# EAGLE design ESP8266 (EAGLE 7.7.0)
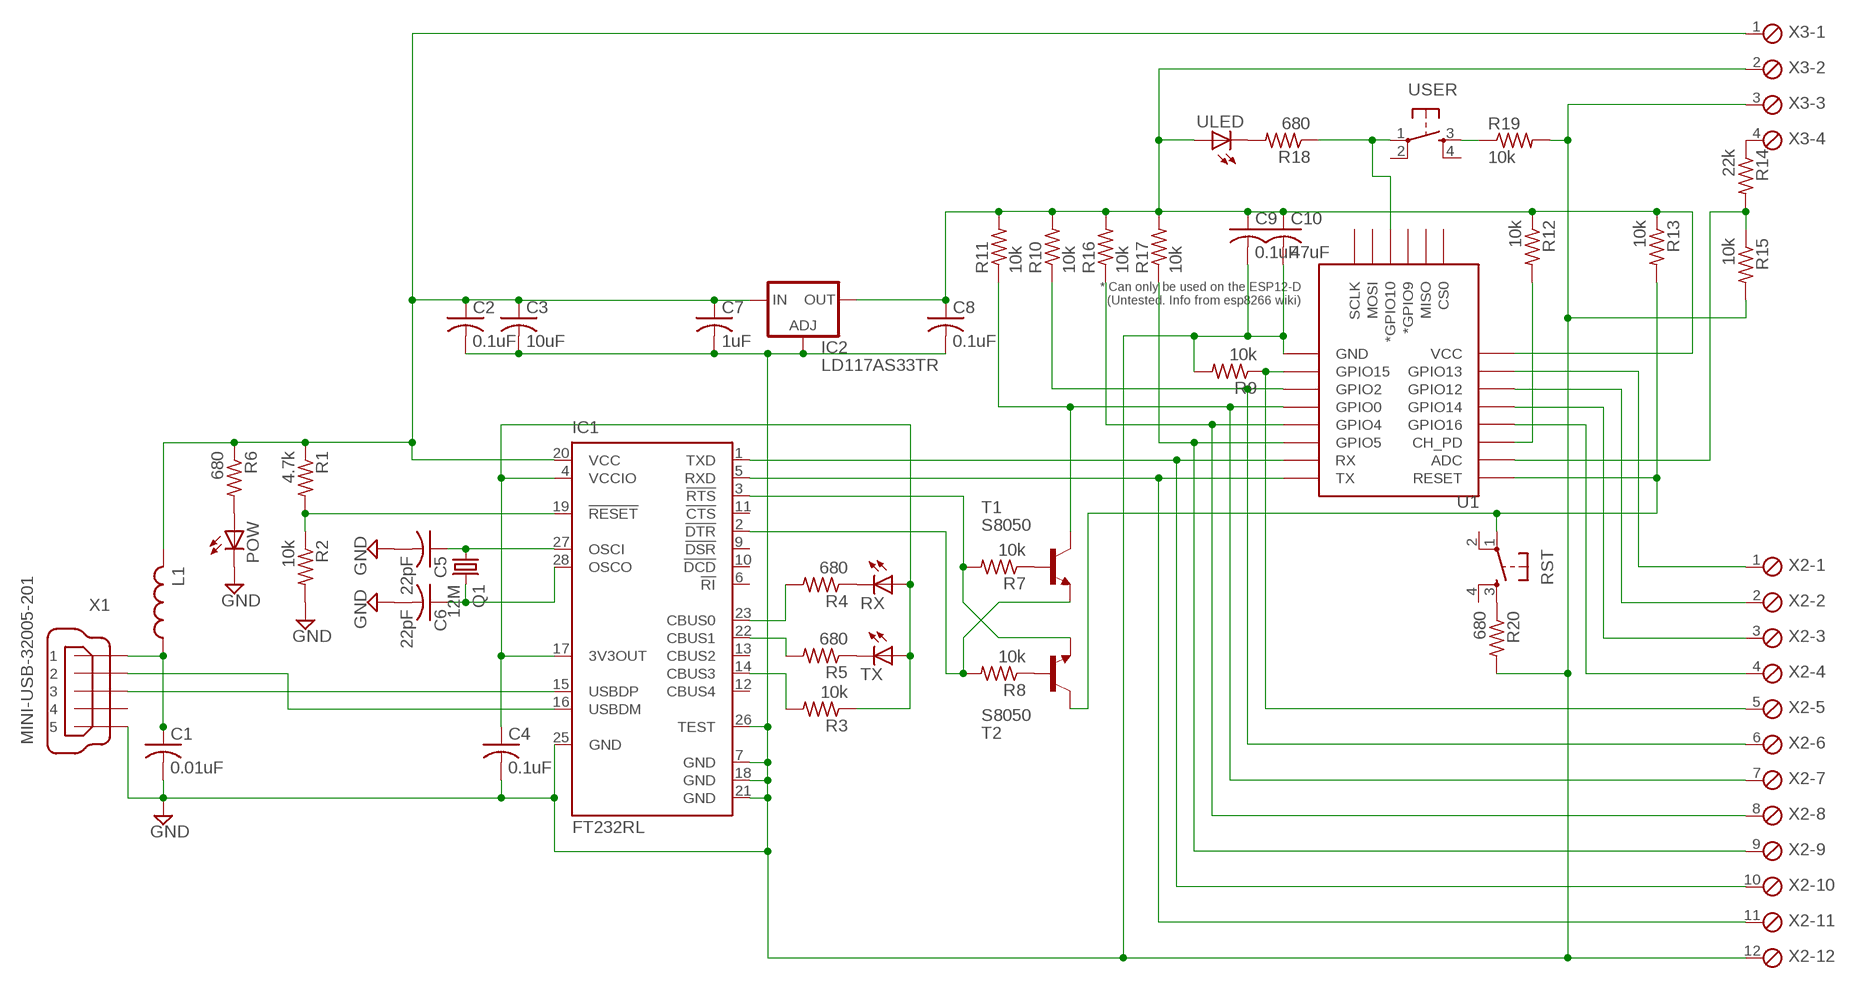
[diagram p0: schematic, sheet 1]

## Parts
C1  0.01uF  C-USC0805  [C0805]
C2  0.1uF  C-USC0805  [C0805]
C3  10uF  C-USC0805  [C0805]
C4  0.1uF  C-USC0805  [C0805]
C5  22pF  C-USC0805  [C0805]
C6  22pF  C-USC0805  [C0805]
C7  1uF  C-USC0805  [C0805]
C8  0.1uF  C-USC0805  [C0805]
C9  0.1uF  C-USC0805  [C0805]
C10  47uF  C-USC0805  [C0805]
IC1  FT232RL  [SSOP28]
IC2  LD117AS33TR  [SOT223]
L1  L-USL2012C  [L2012C]
POW  LEDCHIP-LED0805  [CHIP-LED0805]
Q1  12M  CRYSTALSM49  [SM49]
R1  4.7k  R-US_R0805  [R0805]
R2  10k  R-US_R0805  [R0805]
R3  10k  R-US_R0805  [R0805]
R4  680  R-US_R0805  [R0805]
R5  680  R-US_R0805  [R0805]
R6  680  R-US_R0805  [R0805]
R7  10k  R-US_R0805  [R0805]
R8  10k  R-US_R0805  [R0805]
R9  10k  R-US_R0805  [R0805]
R10  10k  R-US_R0805  [R0805]
R11  10k  R-US_R0805  [R0805]
R12  10k  R-US_R0805  [R0805]
R13  10k  R-US_R0805  [R0805]
R14  22k  R-US_R0805  [R0805]
R15  10k  R-US_R0805  [R0805]
R16  10k  R-US_R0805  [R0805]
R17  10k  R-US_R0805  [R0805]
R18  680  R-US_R0805  [R0805]
R19  10k  R-US_R0805  [R0805]
R20  680  R-US_R0805  [R0805]
RST  DTSM-6  [DTSM-6]
RX  LEDCHIP-LED0805  [CHIP-LED0805]
T1  S8050  MMBT2222ALT1-NPN-SOT23-BEC  [SOT23-BEC]
T2  S8050  MMBT2222ALT1-NPN-SOT23-BEC  [SOT23-BEC]
TX  LEDCHIP-LED0805  [CHIP-LED0805]
U1  ESP12ESMD  [ESP12E-SMD]
ULED  LEDCHIP-LED0805  [CHIP-LED0805]
USER  DTSM-6  [DTSM-6]
X1  MINI-USB-32005-201  [32005-201]
X2  MPT12  [12POL254]
X3  MPT4  [4POL254]

## Nets
GND: C1.2 C2.2 C3.2 C4.2 C5.2 C6.2 C7.2 C8.2 C9.2 C10.2 IC1.7(GND) IC1.18(GND) IC1.21(GND) IC1.25(GND) IC1.26(TEST) IC2.1(ADJ) POW.C R2.2 R9.2 R15.2 R19.2 R20.2 U1.GND X1.5 X2.12 X3.3
N$1: POW.A R6.2
N$2: IC1.15(USBDP) X1.3
N$3: IC1.16(USBDM) X1.2
N$4: C5.1 IC1.27(OSCI) Q1.1
N$5: C6.1 IC1.28(OSCO) Q1.2
N$6: IC1.19(!RESET) R1.2 R2.1
N$8: IC1.14(CBUS3) R3.2
N$9: IC1.22(CBUS1) R5.2
N$10: IC1.23(CBUS0) R4.2
N$11: R4.1 RX.C
N$12: R5.1 TX.C
N$13: IC1.1(TXD) U1.RXD0(RX) X2.10
N$14: IC1.5(RXD) U1.TXD0(TX) X2.11
N$15: R7.1 T1.B
N$16: R8.1 T2.B
N$17: IC1.3(!RTS) R7.2 T2.E
N$18: IC1.2(!DTR) R8.2 T1.E
N$19: R10.1 U1.GPIO2 X2.6
N$20: R9.1 U1.GPIO15 X2.5
N$21: R16.1 U1.GPIO4 X2.8
N$22: R12.2 U1.CH_PD
N$23: R13.2 RST.1 T2.C U1.RESET
N$24: C4.1 IC1.4(VCCIO) IC1.17(3V3OUT) R3.1 RX.A TX.A
N$25: R14.2 R15.1 U1.ADC
N$28: R17.1 U1.GPIO5 X2.9
N$29: R11.1 T1.C U1.GPIO0 X2.7
N$30: R18.2 ULED.C
N$31: R18.1 U1.GPIO10(*GPIO10) USER.1
N$32: R19.1 USER.3
N$33: R14.1 X3.4
N$34: R20.1 RST.3
N$37: U1.GPIO13 X2.1
N$38: U1.GPIO12 X2.2
N$39: U1.GPIO14 X2.3
N$40: U1.GPIO16 X2.4
V33E: C8.1 C9.1 C10.1 IC2.4(OUT) R10.2 R11.2 R12.1 R13.1 R16.2 R17.2 U1.VCC ULED.A X3.2
VBUS: C1.1 L1.1 X1.1
VCC: C2.1 C3.1 C7.1 IC1.20(VCC) IC2.3(IN) L1.2 R1.1 R6.1 X3.1
Unconnected: IC1.6(!RI) IC1.9(!DSR) IC1.10(!DCD) IC1.11(!CTS) IC1.12(CBUS4) IC1.13(CBUS2) RST.2 RST.4 U1.CS0 U1.GPIO9(*GPIO9) U1.MISO U1.MOSI U1.SCLK USER.2 USER.4 X1.4

## Library data of the parts
C1-C10 = rcl:C-US: CAPACITOR, American symbol
IC1 = ftdichip:FT232R: Source: http://www.ftdichip.com/Documents/DataSheets/DS_FT232R_v104.pdf; MPN: FT232RL; OC_FARNELL: 1146032; OC_NEWARK: 91K9918
IC2 = v-reg:LD117A?*: Low drop fixed and adjustable positive voltage regulators 1 A Source: http://www.st.com/stonline/products/literature/ds/7194/ld1117axx.pdf
L1 = rcl:L-US: INDUCTOR, American symbol
POW RX TX ULED = led:LED: LED OSRAM: - CHIPLED LG R971, LG N971, LY N971, LG Q971, LY Q971, LO R971, LY R971 LH N974, LH R974 LS Q976, LO Q976, LY Q976 LO Q996 - Hyper CHIPLED LW Q18S LB Q993, LB Q99A, LB R99A - SideLED LS A670, LO A670, LY A670, LG A670, LP A670 LB A673, LV A673, LT A673, LW A673 LH A674 LY A675 LS A676, LA A676, LO A676, LY A676, LW A676 LS A679, LY A679, LG A679 - Hyper Micro SIDELED® LS Y876, LA Y876, LO Y876, LY Y876 LT Y87S - SmartLED LW L88C, LW L88S LB L89C, LB L89S, LG L890 LS L89K, LO L89K, LY L89K LS L896, LA L896, LO L896, LY L896 - TOPLED LS T670, LO T670, LY T670, LG T670, LP T670 LSG T670, LSP T670, LSY T670, LOP T670, LYG T670 LG T671, LOG T671, LSG T671 LB T673, LV T673, LT T673, LW T673 LH T674 LS T676, LA T676, LO T676, LY T676, LB T676, LH T676, LSB T676, LW T676 LB T67C, LV T67C, LT T67C, LS T67K, LO T67K, LY T67K, LW E67C LS E67B, LA E67B, LO E67B, LY E67B, LB E67C, LV E67C, LT E67C LW T67C LS T679, LY T679, LG T679 LS T770, LO T770, LY T770, LG T770, LP T770 LB T773, LV T773, LT T773, LW T773 LH T774 LS E675, LA E675, LY E675, LS T675 LS T776, LA T776, LO T776, LY T776, LB T776 LHGB T686 LT T68C, LB T68C - Hyper Mini TOPLED® LB M676 - Mini TOPLED Santana® LG M470 LS M47K, LO M47K, LY M47K Source: http://www.osram.convergy.de LUXEON: - LUMILED® LXK2-PW12-R00, LXK2-PW12-S00, LXK2-PW14-U00, LXK2-PW14-V00 LXK2-PM12-R00, LXK2-PM12-S00, LXK2-PM14-U00 LXK2-PE12-Q00, LXK2-PE12-R00, LXK2-PE12-S00, LXK2-PE14-T00, LXK2-PE14-U00 LXK2-PB12-K00, LXK2-PB12-L00, LXK2-PB12-M00, LXK2-PB14-N00, LXK2-PB14-P00, LXK2-PB14-Q00 LXK2-PR12-L00, LXK2-PR12-M00, LXK2-PR14-Q00, LXK2-PR14-R00 LXK2-PD12-Q00, LXK2-PD12-R00, LXK2-PD12-S00 LXK2-PH12-R00, LXK2-PH12-S00 LXK2-PL12-P00, LXK2-PL12-Q00, LXK2-PL12-R00 Source: www.luxeon.com KINGBRIGHT: KA-3528ASYC Source: www.kingbright.com
Q1 = crystal:CRYSTAL: CRYSTAL; OC_FARNELL: unknown; OC_NEWARK: unknown
R1-R20 = rcl:R-US_: RESISTOR, American symbol
RST USER = switch-tact:DTSM-6
T1 T2 = transistor:*-NPN-: NPN Transistror BF959 corrected 2008.03.06
U1 = esp8266modules:ESP12E: ESP12E Module
X1 = con-cypressindustries:MINI-USB-: MINI USB-B Conector Source: www.cypressindustries.com; OC_FARNELL: unknown; OC_NEWARK: unknown
X2 = con-phoenix-254:MPT12: PHOENIX CONNECTOR; OC_FARNELL: unknown; OC_NEWARK: unknown
X3 = con-phoenix-254:MPT4: PHOENIX CONNECTOR; OC_FARNELL: unknown; OC_NEWARK: unknown

## Board
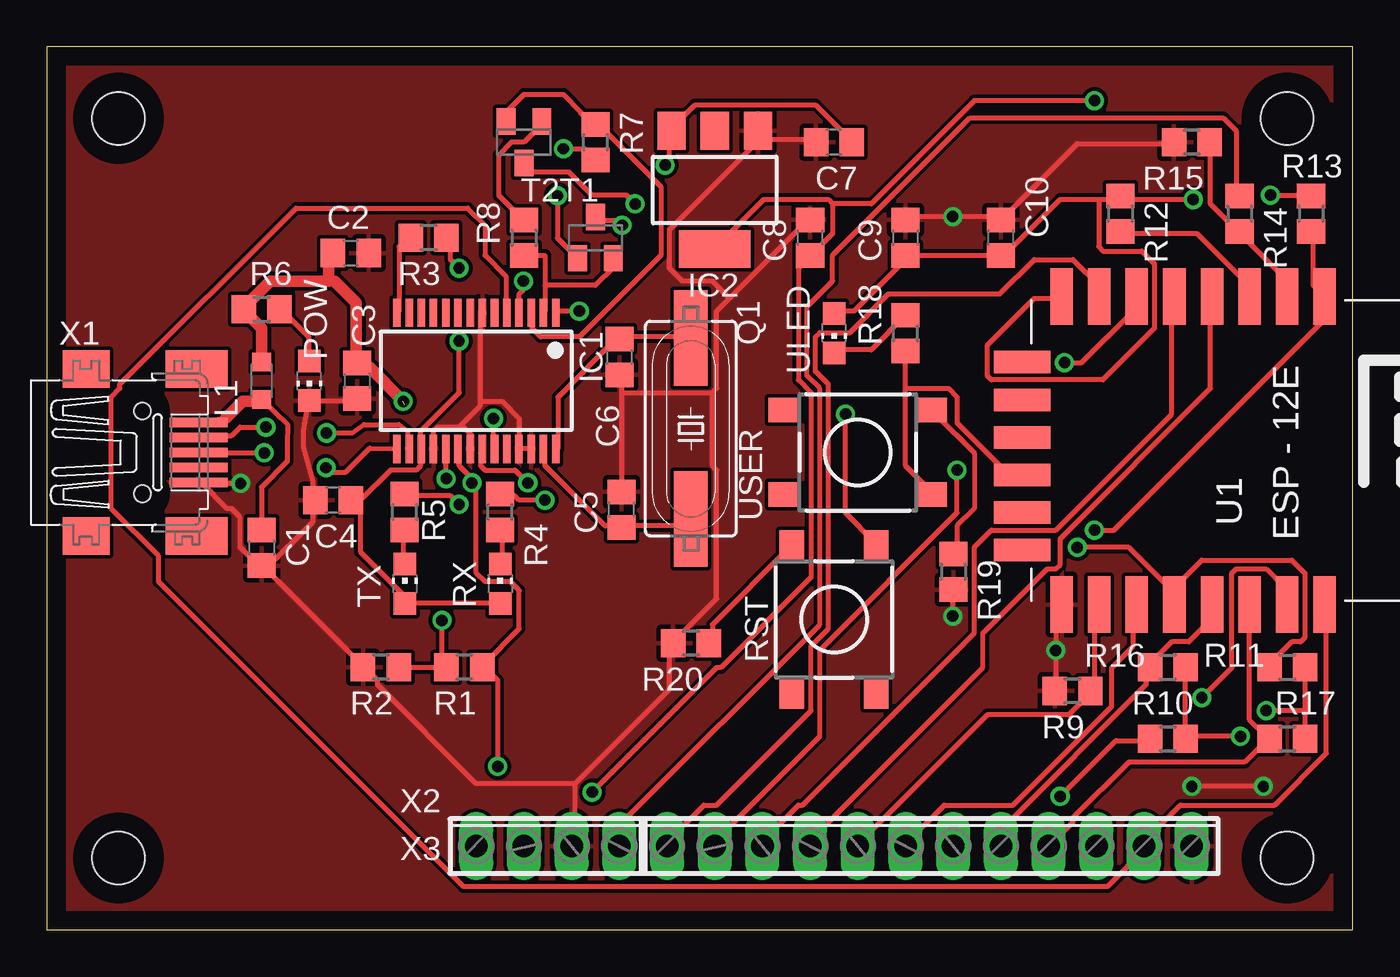
[diagram p1: board, top side]
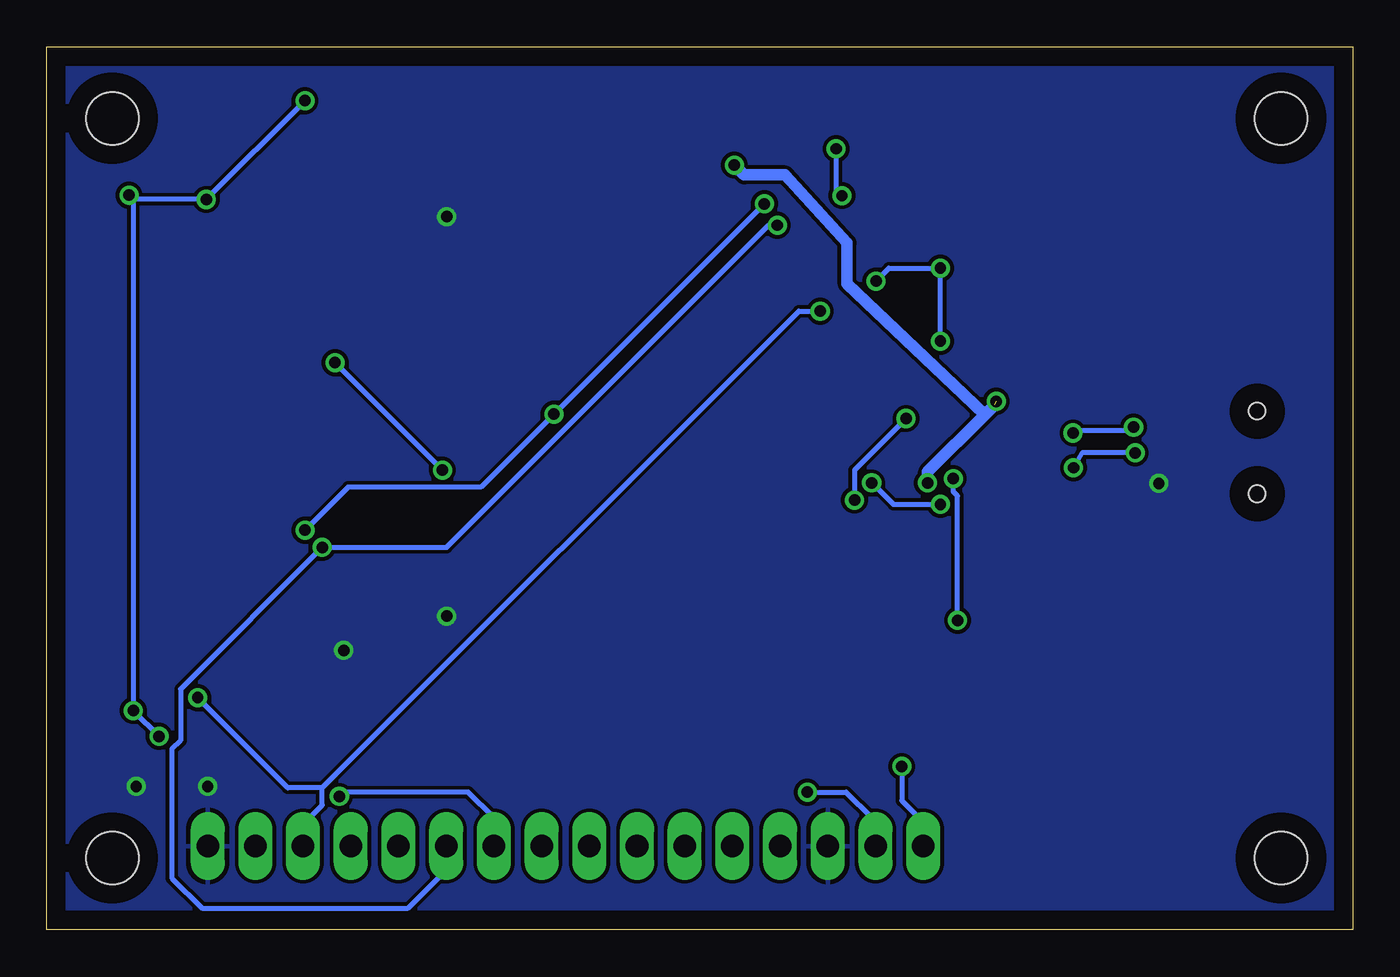
[diagram p2: board, bottom side, seen from below]

Size 69.52 x 46.98 mm. Coordinates in mm from the lower left corner, seen from the top.
Outline: 0,0 69.52,0 69.52,46.98 0,46.98 0,0
Copper layers (1*16): Top 0.035mm / dielectric 1.5mm / Bottom 0.035mm
Design rules "default": minimum track width 10mil, minimum drill 24mil, track to track 8mil, track to pad 8mil, pad to pad 8mil, via to via 8mil, smd to smd 8mil, copper to edge 40mil, drill to drill 8mil, minimum pad ring 10mil, minimum via ring 8mil, stop-mask expansion 4mil, vias tented up to drill 0mil, thermal gap 10mil
Holes 2.8 mm at 3.81,43.18 3.81,3.81 66.04,3.81 66.04,43.18

### Footprints (pad centres in the part's own frame; a part is rotated, then mirrored left to right if it is on the bottom)
C0805 = smd 1.3 x 1.5: 1 -0.95,0; 2 0.95,0
SSOP28 = smd 0.4 x 1.5: 1 -4.225,-3.625; 2 -3.575,-3.625; 3 -2.925,-3.625; 4 -2.275,-3.625; 5 -1.625,-3.625; 6 -0.975,-3.625; 7 -0.325,-3.625; 8 0.325,-3.625; 9 0.975,-3.625; 10 1.625,-3.625; 11 2.275,-3.625; 12 2.925,-3.625; 13 3.575,-3.625; 14 4.225,-3.625; 15 4.225,3.625; 16 3.575,3.625; 17 2.925,3.625; 18 2.275,3.625; 19 1.625,3.625; 20 0.975,3.625; 21 0.325,3.625; 22 -0.325,3.625; 23 -0.975,3.625; 24 -1.625,3.625; 25 -2.275,3.625; 26 -2.925,3.625; 27 -3.575,3.625; 28 -4.225,3.625
SOT223 = smd 1.5 x 2: 1 -2.3,-3.15; 2 0,-3.15; 3 2.3,-3.15 | smd 3.8 x 2: 4 0,3.15
L2012C = smd 1 x 1: 1 -1,0; 2 1,0
CHIP-LED0805 = smd 1.2 x 1.2: A 0,-1.05; C 0,1.05
SM49 = smd 5.08 x 1.778: 1 -4.826,0; 2 4.826,0
R0805 = smd 1.3 x 1.5: 1 -0.95,0; 2 0.95,0
DTSM-6 = smd 1.55 x 1.3: 1 -3.975,2.25; 2 3.975,2.25; 3 -3.975,-2.25; 4 3.975,-2.25
SOT23-BEC = smd 1 x 1.4: B -0.95,-1.1; C 0,1.1; E 0.95,-1.1
ESP12E-SMD = smd 3 x 1.2: ADC -8.3,3.8; CH_PD -8.3,1.8; GND 8.1,-8.2; GPIO0 8.1,-2.2; GPIO2 8.1,-4.2; GPIO4 8.1,-0.2; GPIO5 8.1,1.8; GPIO12 -8.3,-4.2; GPIO13 -8.3,-6.2; GPIO14 -8.3,-2.2; GPIO15 8.1,-6.2; GPIO16 -8.3,-0.2; RESET -8.3,5.8; RXD0 8.1,3.8; TXD0 8.1,5.8; VCC -8.3,-8.2 | smd 1.2 x 3: CS0 -4.8,-10.3; GPIO9 -0.8,-10.3; GPIO10 1.2,-10.3; MISO -2.8,-10.3; MOSI 3.2,-10.3; SCLK 5.2,-10.3
32005-201 = smd 3.1 x 0.5: 1 3,1.6; 2 3,0.8; 3 3,0; 4 3,-0.8; 5 3,-1.6 | smd 2.5 x 2: M1 -3,-4.45; M2 -3,4.45 | smd 3.3 x 2: M3 2.9,4.45; M4 2.9,-4.45 | hole 0.9: 0,2.2; 0,-2.2
12POL254 = drill 1.2 long: 1 -13.97,0; 2 -11.43,0; 3 -8.89,0; 4 -6.35,0; 5 -3.81,0; 6 -1.27,0; 7 1.27,0; 8 3.81,0; 9 6.35,0; 10 8.89,0; 11 11.43,0; 12 13.97,0
4POL254 = drill 1.2 long: 1 -3.81,0; 2 -1.27,0; 3 1.27,0; 4 3.81,0

### Placement (x,y rotation side)
C1  11.43,20.32 270 top
C2  16.18,36.01 0 top
C3  16.51,29.21 270 top
C4  15.24,22.86 180 top
C5  30.6,22.35 90 top
C6  30.48,30.48 270 top
C7  41.91,41.91 180 top
C8  40.64,36.83 90 top
C9  45.72,36.83 90 top
C10  50.8,36.83 90 top
IC1  22.86,29.21 180 top
IC2  35.56,39.37 180 top
L1  11.43,29.21 90 top
POW  13.97,29.21 180 top
Q1  34.29,26.67 90 top
R1  22.23,13.97 180 top
R2  17.78,13.97 180 top
R3  20.32,36.83 180 top
R4  24.13,22.23 90 top
R5  19.05,22.23 90 top
R6  11.43,33.02 0 top
R7  29.21,41.91 90 top
R8  25.4,36.83 270 top
R9  54.61,12.7 180 top
R10  59.69,10.16 0 top
R11  66.04,13.97 0 top
R12  57.15,38.1 270 top
R13  67.31,38.1 270 top
R14  63.5,38.1 270 top
R15  60.96,41.91 180 top
R16  59.69,13.97 0 top
R17  66.04,10.16 0 top
R18  45.72,31.75 90 top
R19  48.26,19.05 270 top
R20  34.29,15.24 180 top
RST  41.91,16.51 270 top
RX  24.13,18.41 0 top
T1  29.21,36.83 0 top
T2  25.4,41.91 180 top
TX  19.05,18.41 0 top
U1  62.23,25.4 270 top
ULED  41.91,31.75 180 top
USER  43.18,25.4 180 top
X1  5.08,25.4 0 top
X2  46.99,4.45 0 top
X3  26.67,4.45 0 top

### Tracks (layer width: path | path; a pad name or v marks a point on that pad's centre or on a via)
GND  (via drill 0.6, 0.61)
  Top 0.254: 25.15,25.6 25.6,25.6 IC1.26 | 21.95,26.75 22.17,26.75 22.63,26.29 22.63,25.6 IC1.21 | 21.95,26.75 20.8,26.75 20.57,26.52 20.57,25.6 IC1.18 | 23.09,28.12 23.09,27.89 21.95,26.75 | 23.09,28.12 23.09,32.69 IC1.7 | 25.15,25.6 25.15,27.2 24.23,28.12 23.09,28.12 | 25.15,25.6 IC1.25 | C3.2 16.46,28.12 14.17,28.12 POW.C 13.95,28.12 13.65,26.58 13.65,25.66 14.17,23.88 14.17,22.86 | 11.66,19.2 11.43,19.43 C1.2 | 11.66,19.2 16.69,14.17 R2.2 16.92,13.95 17.6,13.26 17.6,13.03 22.86,7.77 28.12,7.77 | 14.17,22.86 14.17,21.72 11.66,19.2 | 11.66,19.2 C1.2 | 14.17,22.86 C4.2 | X1.5 8.23,23.77 9.6,22.4 9.83,22.4 10.29,21.95 10.29,20.34 11.43,19.2 C1.2 | 38.18,42.29 37.95,42.52 IC2.1 38.18,42.29 | 38.18,42.29 38.41,42.06 40.92,42.06 C7.2 | 30.63,28.57 30.63,23.32 C5.2 | 30.63,28.57 30.63,29.49 C6.2 | 36.35,33.6 35.66,32.92 35.66,28.8 35.43,28.57 | 36.35,33.6 40.46,37.72 C8.2 | 30.63,28.57 35.43,28.57 | 38.18,42.29 33.15,37.26 33.15,35.2 33.83,34.52 35.43,34.52 36.35,33.6 | C9.2 45.72,37.95 v48.23,37.95 50.75,37.95 C10.2 50.98,37.95 54.86,41.83 59.89,41.83 R15.2 | R9.2 53.72,12.8 v53.72,14.86 53.72,16.92 53.95,17.14 U1.GND | 28.12,7.77 33.15,12.8 33.15,15.09 R20.2 33.38,15.32 35.66,17.6 35.66,24.46 35.43,24.69 35.43,28.57 | 28.12,7.77 28.12,4.57 X3.3 | v48.23,16.69 48.23,18.06 R19.2 | 8.44,23.75 v10.31,23.75 | v64.77,7.62 v60.96,7.62
  pour Bottom: -5.08,50.8 80.01,50.8 80.01,-2.54 -5.08,-2.54
  pour Top: -1.27,48.26 69.85,48.26 69.85,-1.27 -1.27,-1.27
N$1
  Top 0.254: POW.A 13.95,30.4 13.95,31.55 12.57,32.92 R6.2
N$2  (via drill 0.61)
  Top 0.254: v14.86,24.58 15.09,24.35 15.92,24.35 17.19,25.62 18.52,25.6 IC1.15 | v11.57,25.38 8.23,25.38 X1.3
  Bottom 0.254: v14.86,24.58 14.4,25.38 v11.57,25.38
N$3  (via drill 0.61)
  Top 0.254: v14.88,26.43 16.27,26.43 16.88,26.88 18.75,26.88 19.2,26.52 19.2,25.6 IC1.16 | v11.66,26.75 10.29,26.75 9.83,26.29 8.23,26.29 X1.2
  Bottom 0.254: v11.66,26.75 11.88,26.56 14.38,26.56 v14.88,26.43
N$4
  Top 0.254: Q1.1 34.29,21.72 34.06,21.49 30.63,21.49 C5.1 30.4,21.49 29.72,21.49 26.52,24.69 26.52,25.38 IC1.27
N$5
  Top 0.254: IC1.28 27.2,25.6 27.2,28.35 30.4,31.55 C6.1 30.63,31.55 34.29,31.55 Q1.2
N$6  (via drill 0.61)
  Top 0.254: 21.03,13.95 21.26,13.95 R1.2 21.03,13.95 | 21.03,13.95 18.75,13.95 R2.1 | v21.26,24 21.26,25.38 IC1.19 | 21.03,13.95 v21.03,16.46
  Bottom 0.254: v21.26,24 21.26,23.32 21.03,23.09 v21.03,16.46
N$8
  Top 0.254: IC1.14 18.75,32.92 18.75,36.35 19.2,36.8 R3.2
N$9  (via drill 0.61)
  Top 0.254: v21.95,22.63 21.49,23.09 19.2,23.09 R5.2 | v25.6,23.77 24.92,24.46 23.32,24.46 23.09,24.69 23.09,25.38 IC1.22
  Bottom 0.254: v21.95,22.63 24.46,22.63 v25.6,23.77
N$10  (via drill 0.61)
  Top 0.254: v26.52,22.86 25.15,22.86 24.92,23.09 24.23,23.09 R4.2 | v23.77,27.2 23.77,25.6 IC1.23
  Bottom 0.254: v26.52,22.86 26.52,24.46 v23.77,27.2
N$11
  Top 0.254: RX.C 24.23,19.66 24.23,21.26 R4.1
N$12
  Top 0.254: TX.C 18.97,19.66 18.97,21.26 R5.1
N$13  (via drill 0.61)
  Top 0.254: v28.35,32.92 27.2,32.92 IC1.1 | v61.49,12.34 63.09,13.95 63.09,18.97 63.32,19.2 64.92,19.2 65.84,18.29 65.84,17.37 U1.RXD0
  Bottom 0.254: v28.35,32.92 29.49,32.92 54.86,7.54 | 54.86,7.54 54.86,6.63 55.78,5.71 55.78,4.57 X2.10 | v61.49,12.34 56.69,7.54 54.86,7.54
N$14
  Top 0.254: IC1.5 24.46,32.92 24.46,34.75 23.32,35.89 23.32,37.49 22.4,38.41 13.26,38.41 3.89,29.03 3.89,28.8 3.43,28.35 3.43,22.4 5.94,19.89 5.94,18.52 22.17,2.29 56.46,2.29 58.52,4.34 X2.11 58.29,4.57 60.35,6.63 65.38,6.63 68.12,9.37 68.12,17.14 U1.TXD0
N$15  (via drill 0.6)
  Top 0.254: 29.26,40.92 R7.1 28.61,41.56 v27.5,41.56 | v27.19,39.06 27.19,36.8 T1.B
  Bottom 0.254: v27.5,41.56 27.5,39.38 v27.19,39.06
N$16
  Top 0.254: 25.38,37.95 R8.1 25.34,37.78 24.06,39.06 24.06,41.25 24.72,41.91 25.4,41.91 26.35,42.86 T2.B
N$17
  Top 0.254: 29.03,42.98 R7.2 | IC1.3 25.83,32.69 25.83,32 26.29,31.55 28.35,31.55 32.69,35.89 32.69,39.55 29.26,42.98 R7.2 | T2.E 24.45,43.5 25.4,44.45 27.5,44.45 28.44,43.51 28.44,43.44 29.02,42.86 R7.2
N$18
  Top 0.254: R8.2 25.6,35.89 26.52,35.89 26.52,34.29 | 26.52,34.29 26.52,32.92 IC1.2 | T1.E 30.16,35.24 29.21,34.29 26.52,34.29
N$19  (via drill 0.61)
  Top 0.254: v53.95,7.09 56.92,10.06 58.52,10.06 R10.1 | U1.GPIO2 57.84,17.14 57.84,15.09 56.69,13.95 56.69,11.89 51.44,6.63 47.78,6.63 45.72,4.57 X2.6
  Bottom 0.254: v53.95,7.09 53.72,7.32 47.09,7.32 45.72,5.94 X2.6
N$20
  Top 0.254: U1.GPIO15 56.01,17.14 55.78,16.92 55.78,12.8 R9.1 55.55,12.57 54.41,11.43 50.06,11.43 43.2,4.57 X2.5
N$21
  Top 0.254: U1.GPIO4 61.95,17.14 61.95,16.46 60.81,15.32 59.89,15.32 58.75,14.17 R16.1 58.52,13.95 58.52,13.03 50.98,5.49 50.98,4.57 X2.8
N$22
  Top 0.254: R12.2 57.15,37.03 61.27,37.03 64.01,34.29 64.01,33.83 U1.CH_PD
N$23  (via drill 0.61)
  Top 0.254: R13.2 67.44,37.03 67.44,34.29 67.89,33.83 U1.RESET 67.89,33.6 67.89,32.33 56.82,21.26 v55.78,21.26 | v31.32,38.63 30.86,39.09 29.03,39.09 27.81,40.31 25.9,40.31 T2.C 25.6,40.69 | v42.52,27.43 42.52,22.17 44.12,20.57 RST.1
  Bottom 0.254: v31.32,38.63 v42.52,27.43 46.41,23.55 53.49,23.55 v55.78,21.26
N$24  (via drill 0.61)
  Top 0.254: v21.95,35.2 21.49,35.66 21.49,36.8 R3.1 | v25.38,34.52 25.38,34.06 25.15,33.83 25.15,32.92 IC1.4 | RX.A 24,17.37 19.2,17.37 TX.A 18.97,17.37 18.97,17.83 16.69,20.12 16.69,22.86 | 16.69,22.86 C4.1 16.23,22.86 | 16.69,22.86 18.29,24.46 19.66,24.46 19.89,24.69 19.89,25.38 IC1.17 19.89,25.6 19.89,26.52 21.95,28.57 v21.95,31.32
  Bottom 0.254: v25.38,34.52 24.69,35.2 v21.95,35.2 v21.95,31.32
N$25
  Top 0.254: U1.ADC 65.84,33.83 65.84,34.75 63.55,37.03 R14.2 63.32,37.26 61.95,38.63 61.95,41.83 R15.1
N$28
  Top 0.254: U1.GPIO5 64.01,17.14 64.01,11.2 64.92,10.29 R17.1 64.92,10.06 63.78,8.91 57.61,8.91 54.63,5.94 54.63,5.71 53.49,4.57 X2.9
N$29  (via drill 0.61)
  Top 0.254: v30.63,37.49 30.4,37.72 29.26,37.72 T1.C | v54.86,20.34 57.61,20.34 59.89,18.06 | 59.89,18.06 59.89,17.37 U1.GPIO0 59.89,18.06 | 59.89,18.06 61.49,19.66 66.29,19.66 66.98,18.97 66.98,15.54 66.75,15.32 66.29,15.32 65.15,14.17 R11.1
  Bottom 0.254: v30.63,37.49 31.09,37.49 48.23,20.34 v54.86,20.34 62.41,12.8 62.41,10.06 62.87,9.6 62.87,2.74 61.27,1.14 50.29,1.14 48.46,2.97 48.46,4.34 X2.7
N$30
  Top 0.254: ULED.C 42.06,30.86 43.89,30.86 R18.2
N$31
  Top 0.254: 45.72,28.8 45.72,24.69 47.09,23.32 USER.1 | 45.72,28.8 R18.1 | 45.72,28.8 48.01,28.8 48.46,28.35 48.46,26.98 51.21,24.23 51.89,24.23 U1.GPIO10
N$32
  Top 0.254: R19.1 48.46,20.12 48.46,21.49 49.38,22.4 49.38,25.38 47.32,27.43 USER.3
N$33
  Top 0.254: R14.1 63.32,39.09 63.32,42.52 62.64,43.2 49.15,43.2 41.83,35.89 41.83,34.52 40.46,33.15 40.46,29.49 41.15,28.8 41.15,16.23 30.63,5.71 30.63,4.57 X3.4
N$34
  Top 0.254: R20.1 35.43,15.32 35.43,16.23 39.55,20.34 RST.3
N$37
  Top 0.254: U1.GPIO13 56.01,33.83 56.01,34.29 54.63,35.66 52.58,35.66 50.75,33.83 44.81,33.83 42.75,31.77 41.15,31.77 40.92,31.55 40.92,29.72 41.6,29.03 41.6,16 40.69,15.09 40.69,11.66 35.66,6.63 34.98,6.63 32.92,4.57 X2.1
N$38  (via drill 0.61)
  Top 0.254: v54.18,30.18 55.09,30.18 57.84,32.92 57.84,33.6 U1.GPIO12 | v48.46,24.46 48.46,22.17 41.15,14.86 41.15,10.29 35.43,4.57 X2.2
  Bottom 0.254: v48.46,24.46 v54.18,30.18
N$39
  Top 0.254: U1.GPIO14 59.89,33.6 59.89,27.43 53.72,21.26 50.29,21.26 49.38,20.34 49.38,15.77 40.23,6.63 40.01,6.63 37.95,4.57 X2.3
N$40
  Top 0.254: U1.GPIO16 61.95,33.6 61.95,28.8 53.95,20.8 53.95,19.43 53.72,19.2 53.26,19.2 49.84,15.77 49.84,13.95 40.46,4.57 X2.4
V33E  (via drill 0.61)
  Top 0.254: 41.83,38.63 41.83,37.03 40.69,35.89 C8.1 40.46,35.66 40.01,35.2 40.01,29.26 40.69,28.57 40.69,18.75 35.89,13.95 35.66,13.95 v29.03,7.32 | 41.83,38.63 41.6,38.86 38.18,38.86 35.66,36.35 IC2.4 | R16.2 60.58,13.95 60.58,10.29 R10.2 60.81,10.29 v63.55,10.29 | 66.98,11.66 66.98,13.95 R11.2 | 66.98,11.66 66.98,10.29 R17.2 | 66.98,11.66 v64.92,11.66 | ULED.A 42.06,32.92 42.98,32.92 45.72,35.66 C9.1 50.75,35.89 C10.1 50.98,35.89 53.95,38.86 56.01,38.86 | 56.01,38.86 57.15,38.86 | v65.15,39.09 67.21,39.09 R13.1 | 57.15,38.86 v61.04,38.86 | 57.15,38.86 R12.1 | 56.01,38.86 56.01,36.35 56.24,36.12 58.29,36.12 58.98,35.43 58.98,32 56.24,29.26 50.29,29.26 50.06,29.49 50.06,31.09 52.58,33.6 53.95,33.6 U1.VCC | 41.83,38.63 43.89,38.63 49.38,44.12 v55.78,44.12
  Bottom 0.254: v29.03,7.32 26.98,7.32 25.6,5.94 25.6,4.57 X3.2 | v63.55,10.29 v64.92,11.66 64.92,38.86 | 64.92,38.86 v61.04,38.86 v55.78,44.12 | 64.92,38.86 v65.15,39.09
VBUS
  Top 0.254: 11.43,28.12 L1.1 | 9.5,27.2 X1.1 | C1.1 11.43,23.55 12.8,24.92 12.8,25.83 12.81,26.88 L1.1 | 11.43,28.35 L1.1
  Top 0.61: 11.43,28.12 10.41,28.12 9.5,27.2
VCC  (via drill 0.61)  (1 unrouted)
  Top 0.254: C7.1 42.75,42.06 40.92,43.89 34.52,43.89 33.38,42.75 IC2.3 33.15,42.52 33.15,40.92 v32.92,40.69 | 10.52,32.92 R6.1 10.52,33.15 | 16.46,30.18 C3.1 16.69,29.95 17.14,29.95 | 15.32,34.52 15,34.52 | 22.63,24 22.86,23.77 22.86,18.97 23.32,18.52 24.69,18.52 25.15,18.06 25.15,16 23.32,14.17 R1.1 23.32,13.95 24,13.26 v24,8.69 | 22.63,24 21.95,24.69 21.95,25.38 IC1.20 | 22.63,24 v22.63,23.77
  Top 0.305: C2.1 15,35.62
  Top 0.61: L1.2 11.43,32 10.52,32.92 | 16.46,30.18 16.46,33.38 15.32,34.52 | 10.52,33.15 11.89,34.52 15,34.52 15,35.62 | v18.97,28.12 17.14,29.95
  Bottom 0.254: X3.1 22.86,5.71 24,6.86 v24,8.69 | v22.63,23.77 22.63,24
  Bottom 0.61: 22.63,24 22.63,24.36 19.59,27.4 | 19.59,27.4 19.05,27.94 | v32.92,40.69 32.4,40.17 30.22,40.17 26.91,36.56 26.91,34.37 20.7,28.47 19.59,27.4

### Text on the board
Document: 5 | VCC | V33 | GND | ADC | 13 | 12 | 14 | 16 | 15 | 2 | 0 | 4 | RX | TX | GND